# EAGLE board 68030-RAM-IDE-V02 (EAGLE 6.6.0)
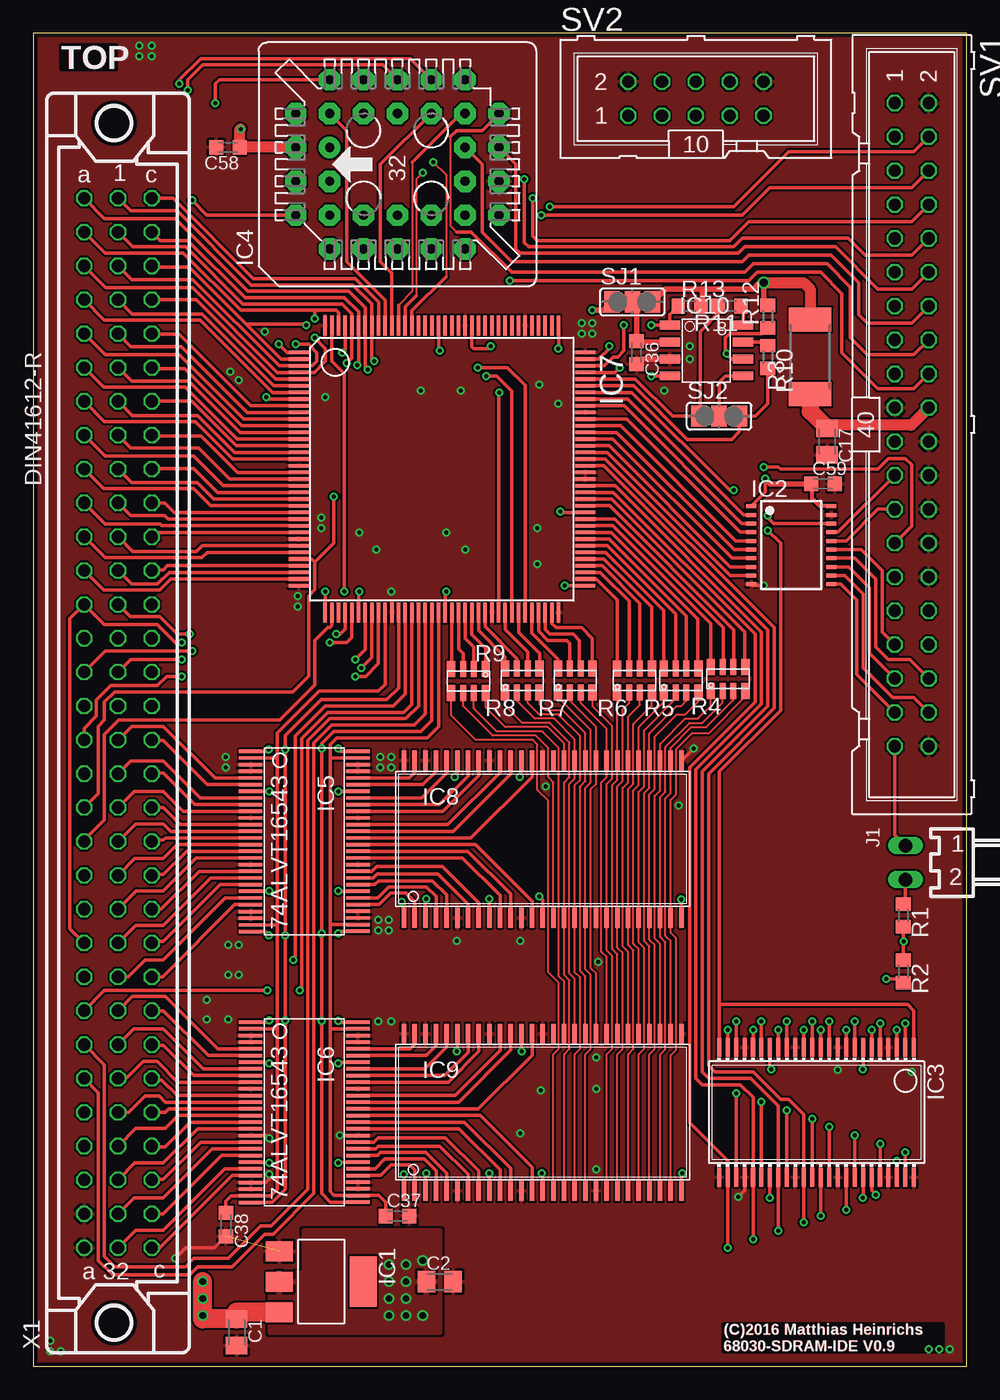
[diagram p3: board, top side]
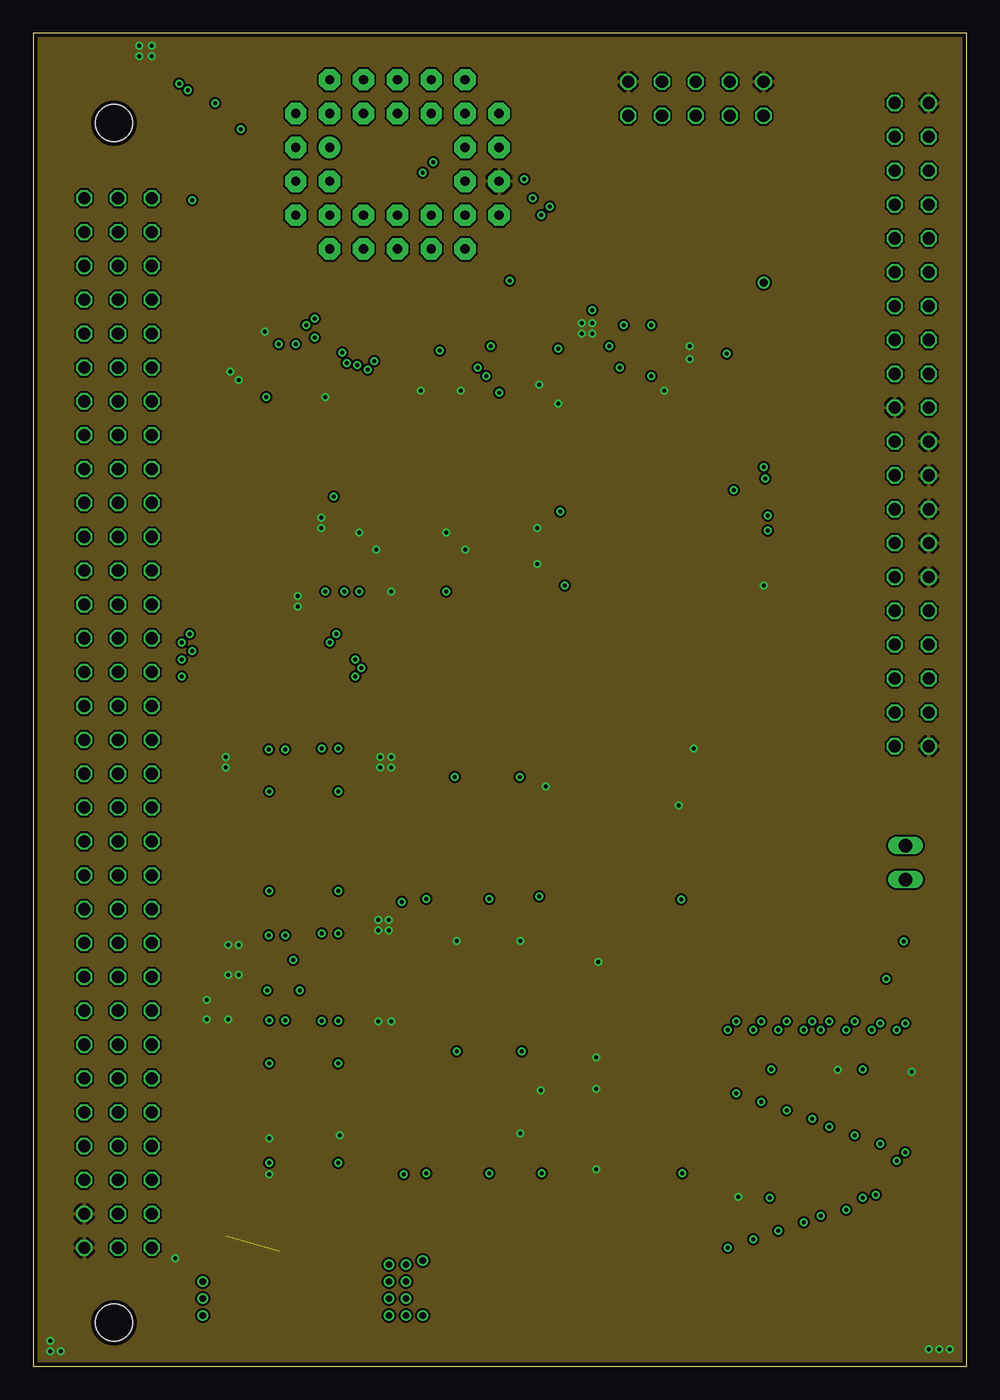
[diagram p4: board, inner layer Route2]
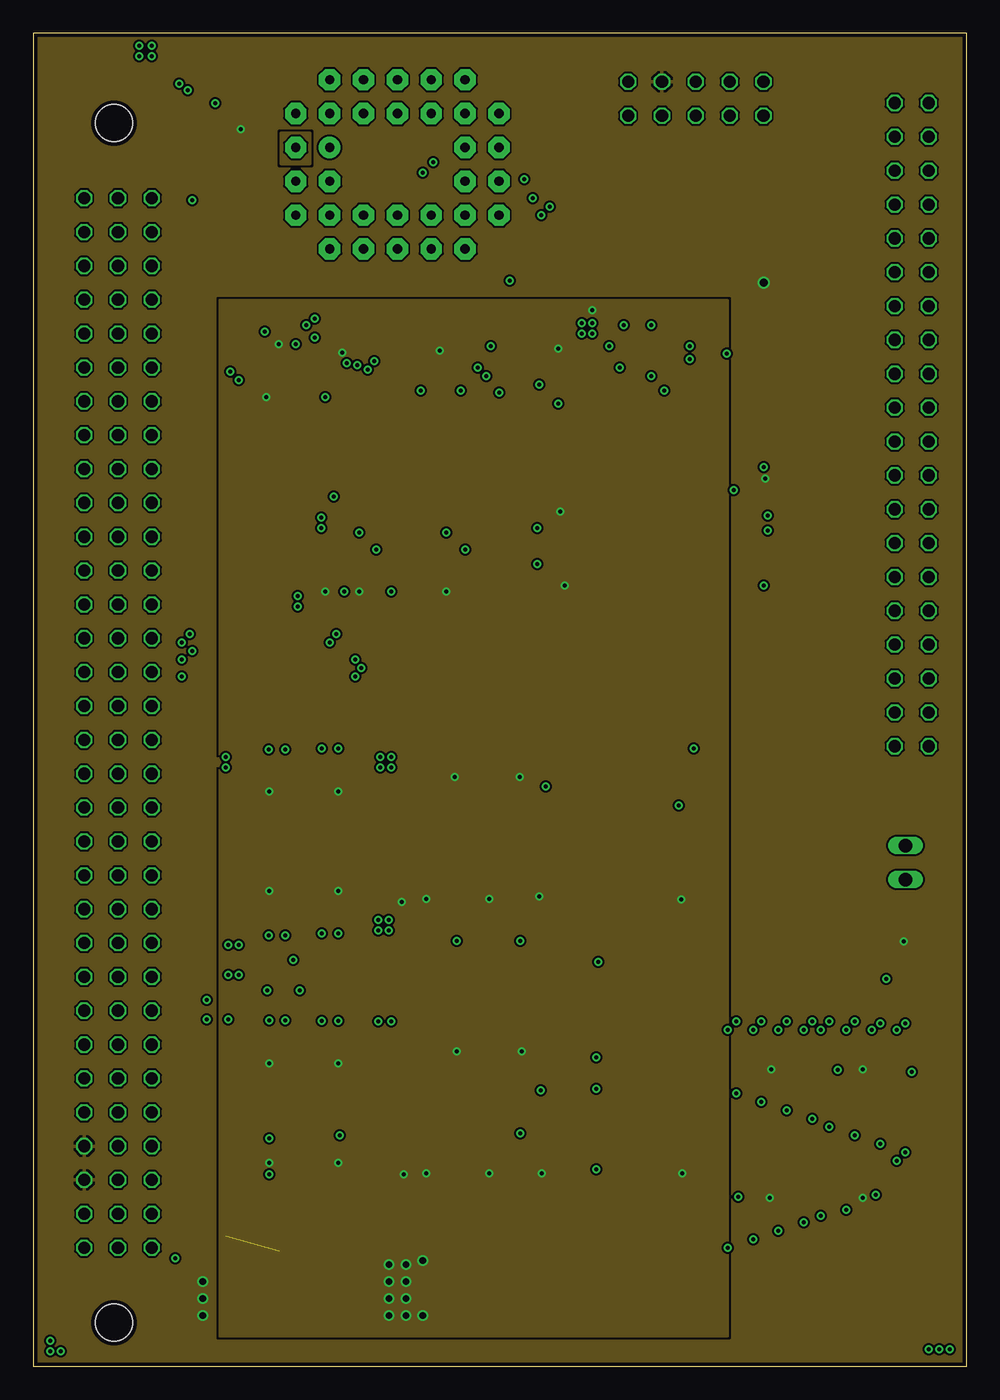
[diagram p5: board, inner layer Route15]
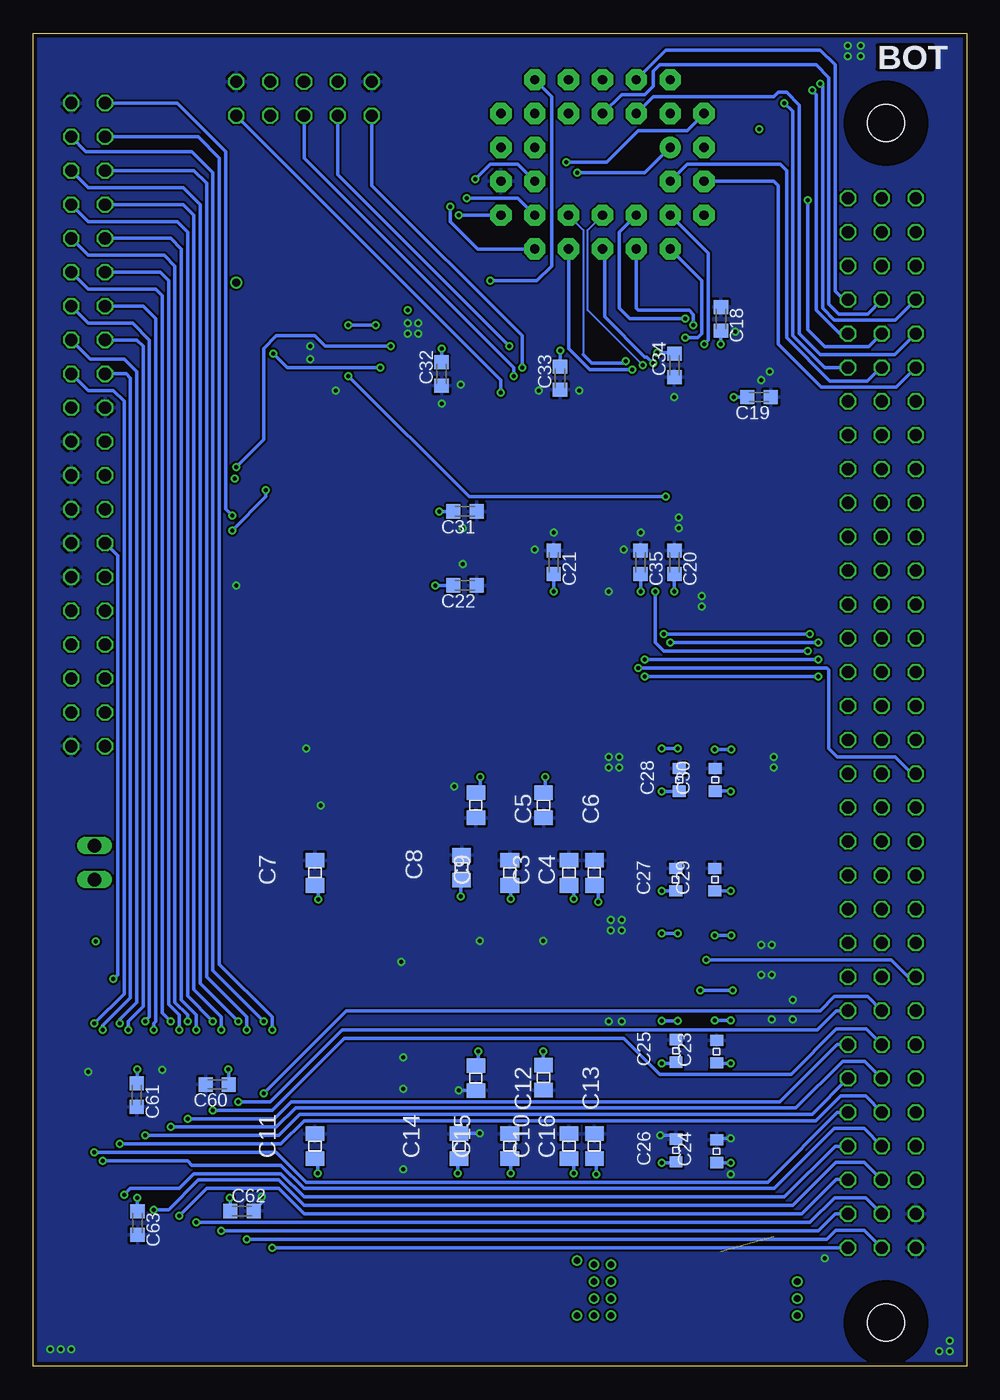
[diagram p6: board, bottom side, seen from below]

Size 69.99 x 100 mm. Coordinates in mm from the lower left corner, seen from the top.
Outline: 0,0 69.99,0 69.99,100 0,100 0,0
Copper layers (1+2*15+16): Top 0.035mm / dielectric 0.36mm / Route2 0.035mm / dielectric 0.71mm / Route15 0.035mm / dielectric 0.36mm / Bottom 0.035mm
Design rules "LeitOn - Standard-Eagle-DRU - 4-Lagen Multilayer - deutsch - Rev 2.0 *": minimum track width 0.15mm, minimum drill 0.3mm, track to track 0.15mm, track to pad 0.15mm, pad to pad 0.15mm, via to via 0.15mm, smd to smd 0.15mm, copper to edge 0.3mm, drill to drill 0.3mm, minimum pad ring 0.15mm, minimum via ring 0.15mm, stop-mask expansion 0.075mm, vias tented up to drill 16mil, thermal gap 0.2mm

## Footprints (pad centres in the part's own frame; a part is rotated, then mirrored left to right if it is on the bottom)
C0805K = smd 1.3 x 1.6: 1 -1,0; 2 1,0
0805 = smd 1.092 x 1.397: 1 -0.94,0; 2 0.94,0
C0603K = smd 1.05 x 1.08: 1 -0.875,0; 2 0.875,0
0603@3 = smd 0.85 x 0.965: 1 -0.846,0; 2 0.846,0
SOT223 = smd 1.499 x 2.007: 1 -2.261,-3.15; 2 0.025,-3.15; 3 2.311,-3.15 | smd 3.81 x 2.007: 4 0,3.15
TSSOP20 = smd 0.3 x 0.75: 1 -2.925,-3; 2 -2.275,-3; 3 -1.625,-3; 4 -0.975,-3; 5 -0.325,-3; 6 0.325,-3; 7 0.975,-3; 8 1.625,-3; 9 2.275,-3; 10 2.925,-3; 11 2.925,3; 12 2.275,3; 13 1.625,3; 14 0.975,3; 15 0.325,3; 16 -0.325,3; 17 -0.975,3; 18 -1.625,3; 19 -2.275,3; 20 -2.925,3
SSOP48DL = smd 0.305 x 1.422: 1 -6.985,-4.877; 2 -6.35,-4.877; 3 -5.715,-4.877; 4 -5.08,-4.877; 5 -4.445,-4.877; 6 -3.81,-4.877; 7 -3.175,-4.877; 8 -2.54,-4.877; 9 -1.905,-4.877; 10 -1.27,-4.877; 11 -0.635,-4.877; 12 0,-4.877; 13 0.635,-4.877; 14 1.27,-4.877; 15 1.905,-4.877; 16 2.54,-4.877; 17 3.175,-4.877; 18 3.81,-4.877; 19 4.445,-4.877; 20 5.08,-4.877; 21 5.715,-4.877; 22 6.35,-4.877; 23 6.985,-4.877; 24 7.62,-4.877; 25 7.62,4.877; 26 6.985,4.877; 27 6.35,4.877; 28 5.715,4.877; 29 5.08,4.877; 30 4.445,4.877; 31 3.81,4.877; 32 3.175,4.877; 33 2.54,4.877; 34 1.905,4.877; 35 1.27,4.877; 36 0.635,4.877; 37 0,4.877; 38 -0.635,4.877; 39 -1.27,4.877; 40 -1.905,4.877; 41 -2.54,4.877; 42 -3.175,4.877; 43 -3.81,4.877; 44 -4.445,4.877; 45 -5.08,4.877; 46 -5.715,4.877; 47 -6.35,4.877; 48 -6.985,4.877
PLCC-SR32 = drill 0.7 pad 1.6: 1 1.27,5.08 | drill 0.7 pad 1.6 octagon: 2 -1.27,7.62; 3 -1.27,5.08; 4 -3.81,7.62; 5 -6.35,5.08; 6 -3.81,5.08; 7 -6.35,2.54; 8 -3.81,2.54; 9 -6.35,0; 10 -3.81,0; 11 -6.35,-2.54; 12 -3.81,-2.54; 13 -6.35,-5.08; 14 -3.81,-7.62; 15 -3.81,-5.08; 16 -1.27,-7.62; 17 -1.27,-5.08; 18 1.27,-7.62; 19 1.27,-5.08; 20 3.81,-7.62; 21 6.35,-5.08; 22 3.81,-5.08; 23 6.35,-2.54; 24 3.81,-2.54; 25 6.35,0; 26 3.81,0; 27 6.35,2.54; 28 3.81,2.54; 29 6.35,5.08; 30 3.81,7.62; 31 3.81,5.08; 32 1.27,7.62
TSSOP56@2 = smd 0.254 x 1.778: 1 -6.762,-4.023; 2 -6.262,-4.023; 3 -5.762,-4.023; 4 -5.262,-4.023; 5 -4.762,-4.023; 6 -4.262,-4.023; 7 -3.762,-4.023; 8 -3.262,-4.023; 9 -2.762,-4.023; 10 -2.262,-4.023; 11 -1.762,-4.023; 12 -1.262,-4.023; 13 -0.762,-4.023; 14 -0.262,-4.023; 15 0.238,-4.023; 16 0.738,-4.023; 17 1.238,-4.023; 18 1.738,-4.023; 19 2.238,-4.023; 20 2.738,-4.023; 21 3.238,-4.023; 22 3.738,-4.023; 23 4.238,-4.023; 24 4.738,-4.023; 25 5.262,-4.023; 26 5.762,-4.023; 27 6.262,-4.023; 28 6.762,-4.023; 29 6.738,4.023; 30 6.238,4.023; 31 5.738,4.023; 32 5.238,4.023; 33 4.738,4.023; 34 4.238,4.023; 35 3.738,4.023; 36 3.238,4.023; 37 2.738,4.023; 38 2.238,4.023; 39 1.738,4.023; 40 1.238,4.023; 41 0.738,4.023; 42 0.238,4.023; 43 -0.262,4.023; 44 -0.762,4.023; 45 -1.262,4.023; 46 -1.762,4.023; 47 -2.262,4.023; 48 -2.762,4.023; 49 -3.262,4.023; 50 -3.762,4.023; 51 -4.262,4.023; 52 -4.762,4.023; 53 -5.262,4.023; 54 -5.762,4.023; 55 -6.262,4.023; 56 -6.762,4.023
TQFP144 = smd 0.27 x 1.5: 1 -8.75,-10.75; 2 -8.25,-10.75; 3 -7.75,-10.75; 4 -7.25,-10.75; 5 -6.75,-10.75; 6 -6.25,-10.75; 7 -5.75,-10.75; 8 -5.25,-10.75; 9 -4.75,-10.75; 10 -4.25,-10.75; 11 -3.75,-10.75; 12 -3.25,-10.75; 13 -2.75,-10.75; 14 -2.25,-10.75; 15 -1.75,-10.75; 16 -1.25,-10.75; 17 -0.75,-10.75; 18 -0.25,-10.75; 19 0.25,-10.75; 20 0.75,-10.75; 21 1.25,-10.75; 22 1.75,-10.75; 23 2.25,-10.75; 24 2.75,-10.75; 25 3.25,-10.75; 26 3.75,-10.75; 27 4.25,-10.75; 28 4.75,-10.75; 29 5.25,-10.75; 30 5.75,-10.75; 31 6.25,-10.75; 32 6.75,-10.75; 33 7.25,-10.75; 34 7.75,-10.75; 35 8.25,-10.75; 36 8.75,-10.75; 73 8.75,10.75; 74 8.25,10.75; 75 7.75,10.75; 76 7.25,10.75; 77 6.75,10.75; 78 6.25,10.75; 79 5.75,10.75; 80 5.25,10.75; 81 4.75,10.75; 82 4.25,10.75; 83 3.75,10.75; 84 3.25,10.75; 85 2.75,10.75; 86 2.25,10.75; 87 1.75,10.75; 88 1.25,10.75; 89 0.75,10.75; 90 0.25,10.75; 91 -0.25,10.75; 92 -0.75,10.75; 93 -1.25,10.75; 94 -1.75,10.75; 95 -2.25,10.75; 96 -2.75,10.75; 97 -3.25,10.75; 98 -3.75,10.75; 99 -4.25,10.75; 100 -4.75,10.75; 101 -5.25,10.75; 102 -5.75,10.75; 103 -6.25,10.75; 104 -6.75,10.75; 105 -7.25,10.75; 106 -7.75,10.75; 107 -8.25,10.75; 108 -8.75,10.75 | smd 1.5 x 0.27: 37 10.75,-8.75; 38 10.75,-8.25; 39 10.75,-7.75; 40 10.75,-7.25; 41 10.75,-6.75; 42 10.75,-6.25; 43 10.75,-5.75; 44 10.75,-5.25; 45 10.75,-4.75; 46 10.75,-4.25; 47 10.75,-3.75; 48 10.75,-3.25; 49 10.75,-2.75; 50 10.75,-2.25; 51 10.75,-1.75; 52 10.75,-1.25; 53 10.75,-0.75; 54 10.75,-0.25; 55 10.75,0.25; 56 10.75,0.75; 57 10.75,1.25; 58 10.75,1.75; 59 10.75,2.25; 60 10.75,2.75; 61 10.75,3.25; 62 10.75,3.75; 63 10.75,4.25; 64 10.75,4.75; 65 10.75,5.25; 66 10.75,5.75; 67 10.75,6.25; 68 10.75,6.75; 69 10.75,7.25; 70 10.75,7.75; 71 10.75,8.25; 72 10.75,8.75; 109 -10.75,8.75; 110 -10.75,8.25; 111 -10.75,7.75; 112 -10.75,7.25; 113 -10.75,6.75; 114 -10.75,6.25; 115 -10.75,5.75; 116 -10.75,5.25; 117 -10.75,4.75; 118 -10.75,4.25; 119 -10.75,3.75; 120 -10.75,3.25; 121 -10.75,2.75; 122 -10.75,2.25; 123 -10.75,1.75; 124 -10.75,1.25; 125 -10.75,0.75; 126 -10.75,0.25; 127 -10.75,-0.25; 128 -10.75,-0.75; 129 -10.75,-1.25; 130 -10.75,-1.75; 131 -10.75,-2.25; 132 -10.75,-2.75; 133 -10.75,-3.25; 134 -10.75,-3.75; 135 -10.75,-4.25; 136 -10.75,-4.75; 137 -10.75,-5.25; 138 -10.75,-5.75; 139 -10.75,-6.25; 140 -10.75,-6.75; 141 -10.75,-7.25; 142 -10.75,-7.75; 143 -10.75,-8.25; 144 -10.75,-8.75
TSOP2-54@2 = smd 0.34 x 1.5: 1 -9,-5.9; 2 -8.2,-5.9; 3 -7.4,-5.9; 4 -6.6,-5.9; 5 -5.8,-5.9; 6 -5,-5.9; 7 -4.2,-5.9; 8 -3.4,-5.9; 9 -2.6,-5.9; 10 -1.8,-5.9; 11 -1,-5.9; 12 -0.2,-5.9; 13 0.6,-5.9; 14 1.4,-5.9; 15 2.2,-5.9; 16 3,-5.9; 17 3.8,-5.9; 18 4.6,-5.9; 19 5.4,-5.9; 20 6.2,-5.9; 21 7,-5.9; 22 7.8,-5.9; 23 8.6,-5.9; 24 9.4,-5.9; 25 10.2,-5.9; 26 11,-5.9; 27 11.8,-5.9; 28 11.8,5.9; 29 11,5.9; 30 10.2,5.9; 31 9.4,5.9; 32 8.6,5.9; 33 7.8,5.9; 34 7,5.9; 35 6.2,5.9; 36 5.4,5.9; 37 4.6,5.9; 38 3.8,5.9; 39 3,5.9; 40 2.2,5.9; 41 1.4,5.9; 42 0.6,5.9; 43 -0.2,5.9; 44 -1,5.9; 45 -1.8,5.9; 46 -2.6,5.9; 47 -3.4,5.9; 48 -4.2,5.9; 49 -5,5.9; 50 -5.8,5.9; 51 -6.6,5.9; 52 -7.4,5.9; 53 -8.2,5.9; 54 -9,5.9
SO-8 = smd 0.66 x 1.524: 1 -1.27,-2.743; 2 0,-2.743; 3 1.27,-2.743; 4 2.54,-2.743; 5 2.54,2.743; 6 1.27,2.743; 7 0,2.743; 8 -1.27,2.743
7395-02 = drill 1.016 long: 1 1.27,0; 2 -1.27,0
R0603 = smd 1 x 1.1: 1 -0.85,0; 2 0.85,0
R2512 = smd 1.8 x 3.2: 1 -2.8,0; 2 2.8,0
R-NETZ@2 = smd 0.63 x 1.2: P$1 -1.3,-0.9; P$4 1.3,-0.9; P$5 1.3,0.9; P$8 -1.3,0.9 | smd 0.45 x 1.2: P$2 -0.4,-0.9; P$3 0.4,-0.9; P$6 0.4,0.9; P$7 -0.4,0.9
SJ_2 = smd 1.168 x 1.6: 1 -1.524,0; 2 0,0; 3 1.524,0
ML40 = drill 0.914 octagon: 1 -24.13,-1.27; 2 -24.13,1.27; 3 -21.59,-1.27; 4 -21.59,1.27; 5 -19.05,-1.27; 6 -19.05,1.27; 7 -16.51,-1.27; 8 -16.51,1.27; 9 -13.97,-1.27; 10 -13.97,1.27; 11 -11.43,-1.27; 12 -11.43,1.27; 13 -8.89,-1.27; 14 -8.89,1.27; 15 -6.35,-1.27; 16 -6.35,1.27; 17 -3.81,-1.27; 18 -3.81,1.27; 19 -1.27,-1.27; 20 -1.27,1.27; 21 1.27,-1.27; 22 1.27,1.27; 23 3.81,-1.27; 24 3.81,1.27; 25 6.35,-1.27; 26 6.35,1.27; 27 8.89,-1.27; 28 8.89,1.27; 29 11.43,-1.27; 30 11.43,1.27; 31 13.97,-1.27; 32 13.97,1.27; 33 16.51,-1.27; 34 16.51,1.27; 35 19.05,-1.27; 36 19.05,1.27; 37 21.59,-1.27; 38 21.59,1.27; 39 24.13,-1.27; 40 24.13,1.27
ML10 = drill 0.914 octagon: 1 -5.08,-1.27; 2 -5.08,1.27; 3 -2.54,-1.27; 4 -2.54,1.27; 5 0,-1.27; 6 0,1.27; 7 2.54,-1.27; 8 2.54,1.27; 9 5.08,-1.27; 10 5.08,1.27
MABC96R = drill 0.914 octagon: A1 -2.54,39.37; A2 -2.54,36.83; A3 -2.54,34.29; A4 -2.54,31.75; A5 -2.54,29.21; A6 -2.54,26.67; A7 -2.54,24.13; A8 -2.54,21.59; A9 -2.54,19.05; A10 -2.54,16.51; A11 -2.54,13.97; A12 -2.54,11.43; A13 -2.54,8.89; A14 -2.54,6.35; A15 -2.54,3.81; A16 -2.54,1.27; A17 -2.54,-1.27; A18 -2.54,-3.81; A19 -2.54,-6.35; A20 -2.54,-8.89; A21 -2.54,-11.43; A22 -2.54,-13.97; A23 -2.54,-16.51; A24 -2.54,-19.05; A25 -2.54,-21.59; A26 -2.54,-24.13; A27 -2.54,-26.67; A28 -2.54,-29.21; A29 -2.54,-31.75; A30 -2.54,-34.29; A31 -2.54,-36.83; A32 -2.54,-39.37; B1 0,39.37; B2 0,36.83; B3 0,34.29; B4 0,31.75; B5 0,29.21; B6 0,26.67; B7 0,24.13; B8 0,21.59; B9 0,19.05; B10 0,16.51; B11 0,13.97; B12 0,11.43; B13 0,8.89; B14 0,6.35; B15 0,3.81; B16 0,1.27; B17 0,-1.27; B18 0,-3.81; B19 0,-6.35; B20 0,-8.89; B21 0,-11.43; B22 0,-13.97; B23 0,-16.51; B24 0,-19.05; B25 0,-21.59; B26 0,-24.13; B27 0,-26.67; B28 0,-29.21; B29 0,-31.75; B30 0,-34.29; B31 0,-36.83; B32 0,-39.37; C1 2.54,39.37; C2 2.54,36.83; C3 2.54,34.29; C4 2.54,31.75; C5 2.54,29.21; C6 2.54,26.67; C7 2.54,24.13; C8 2.54,21.59; C9 2.54,19.05; C10 2.54,16.51; C11 2.54,13.97; C12 2.54,11.43; C13 2.54,8.89; C14 2.54,6.35; C15 2.54,3.81; C16 2.54,1.27; C17 2.54,-1.27; C18 2.54,-3.81; C19 2.54,-6.35; C20 2.54,-8.89; C21 2.54,-11.43; C22 2.54,-13.97; C23 2.54,-16.51; C24 2.54,-19.05; C25 2.54,-21.59; C26 2.54,-24.13; C27 2.54,-26.67; C28 2.54,-29.21; C29 2.54,-31.75; C30 2.54,-34.29; C31 2.54,-36.83; C32 2.54,-39.37 | hole 2.794: -0.305,45; -0.305,-45

## Placement (x,y rotation side)
C1  47µF  [C0805K]  15.24,2.54 270 top
C2  47µF  [C0805K]  30.48,6.35 0 top
C3  100nF  [0805]  29.82,37.01 90 bottom
C4  100nF  [0805]  27.91,37.01 90 bottom
C5  100nF  [0805]  36.8,42.09 270 bottom
C6  100nF  [0805]  31.72,42.09 270 bottom
C7  100nF  [0805]  48.87,37.01 90 bottom
C8  100nF  [0805]  37.87,37.41 90 bottom
C9  100nF  [0805]  34.26,37.01 90 bottom
C10  100nF  [0805]  29.82,16.51 90 bottom
C11  100nF  [0805]  48.87,16.51 90 bottom
C12  100nF  [0805]  36.8,21.62 270 bottom
C13  100nF  [0805]  31.72,21.64 270 bottom
C14  100nF  [0805]  38.07,16.51 90 bottom
C15  100nF  [0805]  34.26,16.51 90 bottom
C16  100nF  [0805]  27.91,16.51 90 bottom
C17  47µF  [C0805K]  59.53,69.37 270 top
C18  100nF  [C0603K]  18.41,78.58 270 bottom
C19  100nF  [C0603K]  15.56,72.71 180 bottom
C20  100nF  [C0603K]  21.91,60.33 270 bottom
C21  100nF  [C0603K]  30.96,60.33 270 bottom
C22  100nF  [C0603K]  37.62,58.58 180 bottom
C23  10nF  [0603@3]  18.75,23.6 90 bottom
C24  10nF  [0603@3]  18.75,16.13 90 bottom
C25  10nF  [0603@3]  21.79,23.65 90 bottom
C26  10nF  [0603@3]  21.79,16.18 90 bottom
C27  10nF  [0603@3]  21.82,36.5 90 bottom
C28  10nF  [0603@3]  21.54,43.99 90 bottom
C29  10nF  [0603@3]  18.87,36.5 90 bottom
C30  10nF  [0603@3]  18.85,43.99 90 bottom
C31  100nF  [C0603K]  37.62,64.14 180 bottom
C32  100nF  [C0603K]  39.37,74.45 90 bottom
C33  100nF  [C0603K]  30.48,74.14 90 bottom
C34  100nF  [C0603K]  21.91,75.09 90 bottom
C35  100nF  [C0603K]  24.45,60.33 270 bottom
C36  100nF  [C0603K]  45.24,76.04 270 top
C37  100pF  [C0603K]  27.3,11.27 0 top
C38  100pF  [C0603K]  14.45,10.64 270 top
C58  100nF  [C0603K]  14.61,91.44 180 top
C59  100nF  [C0603K]  59.21,66.2 0 top
C60  100nF  [C0603K]  56.2,21.14 180 bottom
C61  100nF  [C0603K]  62.23,20.35 270 bottom
C62  100nF  [C0603K]  54.34,11.64 0 bottom
C63  100nF  [C0603K]  62.17,10.74 270 bottom
IC1  REG1117  [SOT223]  21.59,6.35 270 top
IC2  74HCT245PW  [TSSOP20]  56.83,61.59 270 top
IC3  74AC16245  [SSOP48DL]  59.05,19.05 180 top
IC4  AM29F010S  [PLCC-SR32]  27.3,90.17 90 top
IC5  74ALVT16543  [TSSOP56@2]  20.32,39.37 270 top
IC6  74ALVT16543  [TSSOP56@2]  20.32,19.05 270 top
IC7  XC95288XL-TQ144  [TQFP144]  30.64,67.31 270 top
IC8  K4S56163  [TSOP2-54@2]  36.8,39.55 0 top
IC9  K4S56163  [TSOP2-54@2]  36.8,19.05 0 top
IC10  ICS570B  [SO-8]  50.48,76.83 270 top
J1  22-05-7028-02  [7395-02]  65.41,37.78 90 top
R1  330  [R0603]  65.25,33.81 270 top
R2  4k7  [R0603]  65.25,29.62 270 top
R3  500mA  [R2512]  58.26,75.72 90 top
R4  33R  [R-NETZ@2]  52.1,51.58 0 top
R5  33R  [R-NETZ@2]  48.58,51.44 0 top
R6  33R  [R-NETZ@2]  45.09,51.44 0 top
R7  33R  [R-NETZ@2]  40.64,51.44 0 top
R8  33R  [R-NETZ@2]  36.67,51.44 0 top
R9  33R  [R-NETZ@2]  32.63,51.4 180 top
R10  33  [R0603]  55.09,75.72 270 top
R11  33  [R0603]  52.23,79.53 180 top
R12  4k7  [R0603]  55.09,78.74 90 top
R13  4k7  [R0603]  49.21,79.53 0 top
SJ1  [SJ_2]  44.93,79.85 0 top
SJ2  [SJ_2]  51.44,71.28 0 top
SV1  [ML40]  65.88,70.64 270 top
SV2  [ML10]  49.69,95.09 0 top
X1  MABC96R  [MABC96R]  6.35,48.26 0 top

## Tracks (layer width: path | path; a pad name or v marks a point on that pad's centre or on a via)
!AS
  Top 0.254: X1.C12 8.94,59.74 9.73,59.74 10.05,60.06 IC7.33
!DS  (via drill 0.3)
  Top 0.254: X1.A23 2.74,32.82 2.74,56.08 X1.A13 5.33,55.63 9.31,55.63 10.64,54.29 v11.11,54.29 | v22.23,54.29 23.5,54.29 23.89,54.69 IC7.41
  Bottom 0.254: v11.11,54.29 v22.23,54.29
!IDE_ACT
  Top 0.254: SV1.39 64.61,39.85 J1.1
!IDE_R
  Top 0.254: IC2.16 60.97,61.92 63.34,64.29 SV1.25
!IDE_W
  Top 0.254: IC2.17 60.35,62.57 SV1.23
!RESET  (via drill 0.3)
  Top 0.254: X1.A15 5.38,53.65 11.89,53.65 v11.91,53.66 | v23.34,58.1 23.34,74.45 22.39,75.4 IC7.143
  Bottom 0.254: v11.91,53.66 22.7,53.66 23.34,54.29 v23.34,58.1
+3V3  (via drill 0.3, 0.5)
  Top 0.254: IC8.49 31.8,44.4 v31.59,44.2 | IC8.1 27.8,34.68 v27.63,34.85 | IC8.3 29.4,34.99 v29.46,35.05 | IC8.43 36.6,44.33 v36.47,44.2 | IC8.9 34.2,35.04 v34.18,35.05 | IC8.14 38.2,35 v37.95,35.25 | IC8.27 v48.6,34.99 v48.61,35 | IC9.49 31.8,23.68 v31.75,23.62 | IC9.43 36.6,23.64 v36.62,23.62 | IC9.27 48.6,14.42 v48.66,14.48 | IC9.14 38.2,14.42 v38.15,14.48 | IC9.9 34.2,14.46 v34.18,14.48 | IC9.1 27.8,14.38 v27.78,14.4 | IC9.3 29.4,14.42 v29.46,14.48 | v17.68,43.13 IC5.7 | IC5.50 v22.86,43.13 | IC5.22 17.65,35.63 v17.68,35.66 | IC5.35 22.89,35.63 v22.86,35.66 | IC6.22 17.61,15.31 v17.68,15.24 | IC6.35 22.93,15.31 v22.86,15.24 | IC6.7 17.57,22.81 v17.68,22.71 | IC6.50 22.96,22.81 v22.86,22.71 | IC7.55 30.89,58.03 v30.96,58.1 | IC7.73 39.87,58.56 v39.85,58.58 | IC7.37 21.89,58.08 v21.91,58.1 | v23.18,76.04 23.39,76.25 IC7.141 | v39.37,76.36 39.39,76.38 IC7.109 | v39.53,64.14 39.6,64.06 IC7.84 | v24.45,58.1 24.39,58.04 IC7.42 | IC7.8 17.61,72.56 v17.46,72.71 | v18.41,76.68 19.03,76.06 IC7.1 | v30.48,76.2 30.39,76.29 IC7.127
  Top 0.406: SJ1.1 42.77,79.22 v41.91,79.22
  Bottom 0.254: v31.59,44.2 31.59,43.16 C6.1 | v27.63,34.85 27.63,35.79 C4.1 | v29.46,35.05 29.46,35.71 C3.1 | v36.47,44.2 36.47,43.36 C5.1 | v34.18,35.05 34.18,35.99 C9.1 | v37.95,35.25 37.95,36.39 C8.1 | v48.61,35 48.61,35.81 C7.1 | v31.75,23.62 31.75,22.55 C13.1 | v36.62,23.62 36.62,22.73 C12.1 | v48.66,14.48 48.66,15.37 C11.1 | v38.15,14.48 38.15,15.49 C14.1 | v34.18,14.48 34.18,15.49 C15.1 | v27.78,14.4 27.78,15.44 C16.1 | v29.46,14.48 29.46,15.21 C10.1 | C30.1 17.7,43.15 v17.68,43.13 | v22.86,43.13 21.56,43.13 C28.1 | v17.68,35.66 18.86,35.66 C29.1 | v22.86,35.66 21.83,35.66 C27.1 | v17.68,15.24 18.7,15.24 C24.1 | v22.86,15.24 21.89,15.24 C26.1 | v17.68,22.71 18.7,22.71 C23.1 | v22.86,22.71 21.89,22.71 C25.1 | v30.96,58.1 C21.2 | v39.85,58.58 C22.2 | v21.91,58.1 C20.2 | v18.41,76.68 C18.2 | v17.46,72.71 C19.2 | C33.2 v30.48,76.2 | C32.2 v39.37,76.36 | C31.2 v39.53,64.14 | C35.2 v24.45,58.1 | C34.2 21.98,76.04 v23.18,76.04
  other vias: 29.21,3.81 29.21,7.94 27.94,7.62 26.67,7.62 26.67,6.35 27.94,6.35 27.94,5.08 26.67,5.08 26.67,3.81 27.94,3.81
  pour Route15 (rank 2): 13.97,80.01 52.07,80.01 52.07,2.22 13.97,2.22
  pour Top (rank 2): 20.32,10.16 30.48,10.16 30.48,2.54 17.78,2.54 17.78,6.99 20.32,6.99
A0
  Top 0.254: IC7.136 25.89,79.84 24.13,81.6 16.51,81.6 10.48,87.63 X1.C1
A1  (via drill 0.3)
  Top 0.254: X1.B1 7.3,86.68 10.79,86.68 16.35,81.12 23.97,81.12 25.39,79.7 IC7.137 25.39,75.58 v25.56,75.41
  Bottom 0.152: IC4.12 28.73,85.25 28.73,75.88
  Bottom 0.254: 28.73,75.88 28.1,75.25 25.72,75.25 v25.56,75.41
A2  (via drill 0.3)
  Top 0.254: X1.A1 5.33,86.11 10.64,86.11 16.1,80.64 23.65,80.64 24.89,79.41 IC7.138 24.89,74.97 v25.08,74.77
  Bottom 0.254: IC4.11 29.84,76.36 28.26,74.77 v25.08,74.77
A3  (via drill 0.3)
  Top 0.254: 8.94,85.04 X1.C2 9.53,84.45 11.59,84.45 15.88,80.17 23.34,80.17 24.39,79.12 IC7.139 24.39,75.19 v24.29,75.09
  Bottom 0.152: v24.29,75.09 28.42,79.22 28.42,85.25 IC4.10
A4  (via drill 0.3)
  Top 0.254: X1.B2 7.46,83.98 11.43,83.98 15.72,79.69 23.18,79.69 23.89,78.98 IC7.140 23.89,75.64 v23.5,75.25
  Bottom 0.254: IC4.9 27.15,83.66 27.15,78.74 24.13,75.72 23.97,75.72 v23.5,75.25
A5  (via drill 0.3)
  Top 0.254: X1.A2 5.38,83.52 11.26,83.52 15.56,79.22 21.11,79.22 | IC7.142 22.89,79.03 22.7,79.22 21.11,79.22 | v21.11,78.58 21.11,79.22
  Bottom 0.254: IC4.8 26.04,85.09 26.04,79.38 25.24,78.58 v21.11,78.58
A6  (via drill 0.3)
  Top 0.254: X1.C3 8.99,82.45 11.69,82.45 15.95,78.18 | IC7.2 18.58,75.56 15.95,78.18 | 15.95,78.18 20.4,78.18 v20.48,78.11
  Bottom 0.254: IC4.7 24.77,79.38 24.61,79.22 20.8,79.22 20.48,78.9 v20.48,78.11
A7  (via drill 0.3)
  Top 0.254: X1.B3 7.37,81.53 11.97,81.53 18.44,75.06 IC7.3 20.93,75.06 21.27,75.41 21.27,76.04 20.64,76.68 v19.68,76.68
  Bottom 0.254: IC4.6 19.37,83.5 19.37,76.99 v19.68,76.68
A8  (via drill 0.3)
  Top 0.254: X1.A3 5.44,80.92 11.94,80.92 18.31,74.56 IC7.4 21.06,74.56 21.91,75.41 21.91,76.36 v21.11,77.15
  Bottom 0.254: IC4.5 19.84,81.44 19.84,77.47 20.16,77.15 v21.11,77.15
A9
  Top 0.254: X1.C4 12.22,80.01 18.17,74.06 IC7.5
  Bottom 0.254: IC4.27 22.54,98.74 10.95,98.74 9.84,97.63 9.84,80.64 9.21,80.01 X1.C4
A10
  Top 0.254: X1.B4 7.42,78.94 12.66,78.94 18.04,73.56 IC7.6
  Bottom 0.254: IC4.26 25.88,95.41 24.13,95.41 23.5,96.04 23.5,97.16 23.02,97.63 11.27,97.63 10.32,96.68 10.32,79.69 9.57,78.94 7.42,78.94 X1.B4
A11  (via drill 0.3)
  Top 0.254: X1.A4 5.33,78.49 12.52,78.49 17.94,73.06 IC7.7 | IC4.23 28.26,98.11 12.54,98.11 10.95,96.52 v10.95,96.2
  Bottom 0.254: v10.95,96.2 10.79,96.04 10.79,79.38 9.91,78.49 5.33,78.49 X1.A4
A12  (via drill 0.3)
  Top 0.254: X1.C5 8.94,77.42 10.93,77.42 16.29,72.06 IC7.9 | IC4.25 26.19,97.63 12.7,97.63 11.59,96.52 v11.59,95.73
  Bottom 0.254: v11.59,95.73 11.27,95.41 11.27,79.22 9.53,77.47 X1.C5
A13  (via drill 0.3)
  Top 0.254: X1.B5 7.32,76.5 11.09,76.5 16.03,71.56 IC7.10 | IC4.4 13.02,86.36 v11.91,87.47
  Bottom 0.254: v11.91,87.47 11.91,77.79 10.62,76.5 7.32,76.5 X1.B5
A14
  Top 0.254: X1.A5 5.38,75.89 10.93,75.89 15.76,71.06 IC7.11
  Bottom 0.254: IC4.28 23.5,95.25 14.45,95.25 14.13,95.57 13.49,95.57 12.54,94.61 12.54,77.47 10.97,75.89 5.38,75.89 X1.A5
A15  (via drill 0.3)
  Top 0.254: X1.C6 8.99,74.83 11.37,74.83 15.64,70.56 IC7.12 | IC4.29 13.97,96.52 13.65,96.2 v13.65,94.77
  Bottom 0.254: v13.65,94.77 13.02,94.14 13.02,77.31 10.64,74.93 X1.C6
A16
  Top 0.254: X1.B6 7.37,73.91 11.65,73.91 15.51,70.06 IC7.13
  Bottom 0.254: IC4.3 20.95,90.17 13.97,90.17 13.49,89.69 13.49,77.15 10.26,73.91 7.46,73.91 6.45,74.93 X1.B6
A17
  Top 0.254: X1.A6 5.28,73.46 11.4,73.46 15.3,69.56 IC7.14
  Bottom 0.254: IC4.2 14.45,88.9 14.13,88.58 14.13,76.68 10.91,73.46 5.28,73.46 X1.A6
A18
  Top 0.254: X1.C7 11.89,72.39 15.22,69.06 IC7.15
A19
  Top 0.254: X1.B7 7.42,71.32 12.34,71.32 15.1,68.56 IC7.16
A20
  Top 0.254: X1.A7 5.33,70.87 12.16,70.87 14.97,68.06 IC7.17
A21
  Top 0.254: X1.C8 8.94,69.8 12.59,69.8 15.33,67.06 IC7.19
A22
  Top 0.254: X1.B8 7.32,68.89 12.39,68.89 14.72,66.56 IC7.20
A23
  Top 0.254: X1.A8 5.38,68.28 12.04,68.28 14.26,66.06 IC7.21
A24
  Top 0.254: X1.C9 8.94,67.36 12.04,67.36 13.84,65.56 IC7.22
A25
  Top 0.254: X1.B9 7.37,66.29 12.29,66.29 13.52,65.06 IC7.23
A26
  Top 0.254: X1.A9 5.28,65.84 12.04,65.84 13.32,64.56 IC7.24
A27
  Top 0.254: X1.C10 9.84,64.77 10.55,64.06 IC7.25
A28
  Top 0.254: X1.B10 7.3,63.82 9.84,63.82 10.1,63.56 IC7.26
A29
  Top 0.254: X1.A10 5.4,63.18 9.53,63.18 9.65,63.06 IC7.27
A30
  Top 0.254: X1.C11 9.22,62.56 IC7.28
A31
  Top 0.254: X1.B11 7.46,61.12 12.22,61.12 12.66,61.56 IC7.30
ARAM_0
  Top 0.152: IC9.23 45.4,23.4 45.8,23.8 45.8,31.4 45.4,31.8 IC8.23 45.4,43.1 45.8,43.5 45.8,47.7 48.18,50.08 R5.P$2
ARAM_1
  Top 0.152: IC9.24 46.2,23.4 46.6,23.8 46.6,31.6 46.2,32 IC8.24 46.2,42.9 46.6,43.3 46.6,47.23 48.26,48.9 48.9,48.9 49.88,49.88 R5.P$4 49.88,50.51
ARAM_2
  Top 0.152: IC9.25 47,23.39 47.4,23.79 47.4,31.8 47,32.2 IC8.25 47,42.7 47.4,43.1 47.4,46.45 49.21,48.26 50.16,48.26 51.7,49.8 R4.P$2
ARAM_3
  Top 0.152: IC9.26 47.8,23.32 48.2,23.73 48.2,32.11 47.8,32.51 IC8.26 47.8,42.5 48.2,42.9 48.2,46.3 49.42,47.52 50.7,47.52 53.41,50.23 R4.P$4
ARAM_4
  Top 0.152: IC9.29 47.8,31.9 47.4,32.3 47.4,42.6 47.8,43 IC8.29 47.8,46.4 49.34,47.94 50.48,47.94 52.51,49.97 R4.P$3
ARAM_5
  Top 0.152: IC9.30 47,31.7 46.6,32.1 46.6,42.8 47,43.2 IC8.30 47,46.68 48.9,48.58 49.85,48.58 50.8,49.53 R4.P$1
ARAM_6
  Top 0.152: IC9.31 46.2,31.5 45.8,31.9 45.8,43 46.2,43.4 IC8.31 46.2,47.47 48.26,49.53 48.58,49.53 48.98,49.93 R5.P$3 48.98,50.25
ARAM_7
  Top 0.152: IC9.32 45.4,31.3 45,31.7 45,43.2 45.4,43.6 IC8.32 45.4,47.94 47.28,49.82 R5.P$1
ARAM_8
  Top 0.152: IC9.33 44.6,31.1 44.2,31.5 44.2,43.4 44.6,43.8 IC8.33 44.6,48.73 45.48,49.61 R6.P$3
ARAM_9
  Top 0.152: IC9.34 43.8,30.9 43.4,31.3 43.4,43.6 43.8,44 IC8.34 43.8,50.52 R6.P$1
ARAM_10
  Top 0.152: IC9.22 44.6,23.4 45,23.8 45,31.2 44.6,31.6 IC8.22 44.6,43.3 45,43.7 45,48.17 46.38,49.56 R6.P$4
ARAM_11
  Top 0.152: IC9.35 43,30.7 42.6,31.1 42.6,43.8 43,44.2 IC8.35 43,47.8 41.04,49.77 R7.P$3
ARAM_12
  Top 0.152: IC9.36 42.2,29.46 41.8,29.86 41.8,43.3 42.2,43.7 IC8.36 42.2,47.97 40.24,49.93 R7.P$2
BA0
  Top 0.152: IC9.20 43,23.4 43.4,23.8 43.4,30.8 43,31.2 IC8.20 43,43.7 43.4,44.1 43.4,48.04 41.94,49.5 R7.P$4
BA1
  Top 0.152: IC9.21 43.8,23.4 44.2,23.8 44.2,31 43.8,31.4 IC8.21 43.8,43.5 44.2,43.9 44.2,49.28 44.69,49.77 R6.P$2
C_ARAM_0
  Top 0.254: R5.P$7 48.18,56.44 43.06,61.56 IC7.79
C_ARAM_1
  Top 0.254: R5.P$5 49.85,52.37 49.85,56.04 43.33,62.56 IC7.81
C_ARAM_2
  Top 0.254: R4.P$7 51.75,52.52 51.75,55.4 43.6,63.56 IC7.83
C_ARAM_3
  Top 0.254: R4.P$5 53.34,52.54 53.34,55.09 43.37,65.06 IC7.86
C_ARAM_4
  Top 0.254: R4.P$6 52.55,52.52 52.55,55.24 43.23,64.56 IC7.85
C_ARAM_5
  Top 0.254: R4.P$8 50.8,55.72 43.46,63.06 IC7.82
C_ARAM_6
  Top 0.254: R5.P$6 48.98,56.27 43.19,62.06 IC7.80
C_ARAM_7
  Top 0.254: R5.P$8 47.28,56.7 42.92,61.06 IC7.78
C_ARAM_8
  Top 0.254: R6.P$6 45.48,57.23 42.65,60.06 IC7.76
C_ARAM_9
  Top 0.254: R6.P$8 43.78,57.5 42.22,59.06 IC7.74
C_ARAM_10
  Top 0.254: R6.P$5 46.38,56.96 42.79,60.56 IC7.77
C_ARAM_11
  Top 0.254: IC7.70 38.39,55.27 38.73,54.93 40.48,54.93 40.96,54.45 40.96,52.42 R7.P$6
C_ARAM_12
  Top 0.254: R7.P$7 40.24,54.22 40.01,54.45 38.58,54.45 37.89,55.14 IC7.69
C_BA0
  Top 0.254: IC7.71 38.89,55.73 39.21,55.4 41.12,55.4 41.91,54.61 41.91,52.37 R7.P$5
C_BA1
  Top 0.254: R6.P$7 44.69,57.39 42.7,59.37 42.52,59.56 IC7.75
C_CAS
  Top 0.254: R8.P$6 37.07,53.58 35.39,55.26 IC7.64
C_CLK_RAM
  Top 0.254: R8.P$7 36.27,53.1 33.89,55.49 IC7.61
C_CLKEN
  Top 0.254: IC7.66 36.39,55.05 37.97,53.47 R8.P$5
C_IDE_A0
  Top 0.254: IC2.7 52.41,60.62 43.47,69.56 IC7.95
C_IDE_A1
  Top 0.254: IC2.5 52.7,61.92 44.06,70.56 IC7.97
C_IDE_A2
  Top 0.254: IC7.96 43.76,70.06 52.55,61.27 IC2.6
C_IDE_BUFFER_DIR  (via drill 0.3)
  Top 0.254: IC3.1 66.04,26.67 65.56,27.15 51.44,27.15 | 51.44,27.15 51.44,44.61 56.04,49.21 56.04,61.75 v55.09,62.71 | v52.55,65.72 52.23,65.72 44.89,73.06 IC7.102 | IC3.24 51.44,27.15
  Bottom 0.254: v55.09,62.71 52.55,65.25 v52.55,65.72
C_IDE_CS0
  Top 0.254: IC2.9 52.28,59.32 43.04,68.56 IC7.93
C_IDE_CS1
  Top 0.254: IC2.8 52.27,59.97 43.18,69.06 IC7.94
C_IDE_R
  Top 0.254: IC2.4 53,62.57 44.51,71.06 IC7.98
C_IDE_RESET
  Top 0.254: IC2.2 53.29,63.87 44.6,72.56 IC7.101
C_IDE_W
  Top 0.254: IC2.3 53.14,63.22 44.3,72.06 IC7.100 41.4,72.07
C_LDQ0
  Top 0.254: R9.P$1 33.93,53.86 32.89,54.9 IC7.59
C_LDQ1
  Top 0.254: IC7.58 32.39,54.61 33.03,53.96 R9.P$2
C_RAS
  Top 0.254: R7.P$8 39.34,53.05 37.39,55 IC7.68
C_UDQ0
  Top 0.254: IC7.57 31.89,53.8 32.23,53.45 R9.P$3
C_UDQ1
  Top 0.254: R9.P$4 31.33,52.92 31.39,52.98 IC7.56
C_WE
  Top 0.254: R8.P$8 35.37,53.21 33.39,55.19 IC7.60
CAS
  Top 0.152: IC9.17 40.6,23.4 41,23.8 41,29.16 40.6,29.56 IC8.17 40.6,43.6 41,44 41,47.27 39.37,48.9 37.94,48.9 37.07,49.77 R8.P$3
CBACK
  Top 0.254: X1.A26 5.33,22.61 5.33,8.23 6.1,7.47 11.43,7.47 12.04,8.08 14.63,8.08 17.07,10.52 17.83,10.52 20.57,13.26 20.57,46.93 22.23,48.58 27.94,48.58 28.89,49.53 IC7.51
CBREQ  (via drill 0.3)
  Top 0.254: X1.A25 5.33,28.19 v17.53,28.19 | v19.96,28.19 20.12,28.35 20.12,47.1 22.07,49.05 27.78,49.05 28.39,49.66 IC7.50
  Bottom 0.254: v17.53,28.19 v19.96,28.19
CIIN
  Top 0.254: X1.A27 4.88,20.52 4.88,7.92 5.94,6.86 11.73,6.86 12.34,7.47 14.94,7.47 17.37,9.91 17.98,9.91 21.03,12.95 21.03,46.75 22.38,48.1 28.57,48.1 29.39,48.91 IC7.52
CLK  (via drill 0.3)
  Top 0.254: X1.A19 4.88,42.98 4.88,48.01 5.33,48.46 5.33,49.84 6.1,50.6 19.45,50.6 20.64,51.78 20.64,57.78 21.11,58.26 21.11,60.33 | 21.11,60.33 20.88,60.56 IC7.32 | IC10.4 v46.35,74.3 | v22.54,65.25 22.54,61.75 21.11,60.33
  Bottom 0.254: v46.35,74.3 37.31,65.25 v22.54,65.25
CLK_RAM
  Top 0.152: IC9.38 40.6,29.06 40.2,29.46 40.2,43.7 40.6,44.1 IC8.38 40.6,47.03 39.05,48.58 37.62,48.58 36.27,49.93 R8.P$2
CLKEN
  Top 0.152: IC9.37 41.4,29.26 41,29.66 41,43.5 41.4,43.9 IC8.37 41.4,47.5 39.69,49.21 38.42,49.21 37.97,49.66 R8.P$4
D0
  Top 0.254: X1.B17 7.37,48.01 9.75,48.01 13.63,44.13 IC5.5
D1
  Top 0.254: X1.C17 8.94,46.94 9.75,46.94 13.06,43.63 IC5.6
D2
  Top 0.254: X1.B18 7.32,45.41 9.75,45.41 12.54,42.63 IC5.8
D3
  Top 0.254: X1.C18 8.94,44.5 9.75,44.5 12.12,42.13 IC5.9
D4
  Top 0.254: X1.B19 7.57,43.13 9.75,43.13 11.25,41.63 IC5.10
D5
  Top 0.254: X1.C19 9.75,41.91 11.03,40.63 IC5.12
D6
  Top 0.254: X1.B20 7.67,40.69 9.75,40.69 10.31,40.13 IC5.13
D7
  Top 0.254: X1.C20 8.99,39.47 9.75,39.47 9.91,39.63 IC5.14
D8
  Top 0.254: X1.B21 7.62,38.1 9.75,38.1 10.79,39.13 IC5.15
D9
  Top 0.254: X1.C21 8.94,36.88 9.75,36.88 11.51,38.63 IC5.16
D10
  Top 0.254: X1.B22 7.72,35.66 9.75,35.66 12.22,38.13 IC5.17
D11
  Top 0.254: X1.C22 9.6,34.29 12.44,37.13 IC5.19
D12
  Top 0.254: X1.B23 7.67,33.07 9.75,33.07 13.31,36.63 IC5.20
D13
  Top 0.254: X1.C23 8.99,31.85 9.75,31.85 14.03,36.13 IC5.21
D14
  Top 0.254: X1.B24 7.11,29.21 8.38,30.48 9.75,30.48 14.4,35.13 IC5.23
D15
  Top 0.254: X1.C24 9.7,29.21 15.12,34.63 IC5.24
D16  (via drill 0.3)
  Top 0.254: X1.B25 7.42,27.74 9.91,27.74 13.83,23.81 IC6.5 | IC3.27 v52.7,20.48
  Bottom 0.254: v52.7,20.48 46.51,26.67 10.97,26.67 9.91,27.74 7.42,27.74 X1.B25
D17  (via drill 0.3)
  Top 0.254: X1.C25 9.75,26.67 13.11,23.31 IC6.6 | IC3.30 v54.61,19.84
  Bottom 0.254: v54.61,19.84 52.23,19.84 46.83,25.24 11.18,25.24 9.75,26.67 X1.C25
D18  (via drill 0.3)
  Top 0.254: X1.B26 7.52,25.3 9.75,25.3 12.74,22.31 IC6.8 | IC3.33 v56.52,19.21
  Bottom 0.254: v56.52,19.21 52.07,19.21 46.67,24.61 25.72,24.61 23.02,21.91 13.14,21.91 9.75,25.3 7.52,25.3 X1.B26
D19  (via drill 0.3)
  Top 0.254: X1.C26 8.94,24.08 9.75,24.08 12.02,21.81 IC6.9 | IC3.36 v58.42,18.57
  Bottom 0.254: v58.42,18.57 51.91,18.57 50.64,19.84 13.99,19.84 9.7,24.13 X1.C26
D20  (via drill 0.3)
  Top 0.254: X1.B27 6.4,21.64 7.01,21.64 8.23,22.86 9.3,22.86 10.84,21.31 IC6.10 | IC3.38 v59.69,17.94
  Bottom 0.254: v59.69,17.94 51.75,17.94 50.32,19.37 12.79,19.37 9.3,22.86 7.62,22.86 X1.B27
D21  (via drill 0.3)
  Top 0.254: X1.C27 8.99,21.49 9.6,21.49 10.78,20.31 IC6.12 | IC3.41 v61.59,17.3
  Bottom 0.254: v61.59,17.3 51.59,17.3 50.01,18.89 11.59,18.89 X1.C27
D22  (via drill 0.3)
  Top 0.254: X1.B28 7.16,19.05 8.38,20.27 9.45,20.27 9.91,19.81 IC6.13 | IC3.44 v63.5,16.67
  Bottom 0.254: v63.5,16.67 51.44,16.67 49.69,18.41 11.3,18.41 9.45,20.27 7.57,20.27 X1.B28
D23  (via drill 0.3)
  Top 0.254: X1.C28 9.91,19.05 10.17,19.31 IC6.14 | IC3.47 v65.41,16.03
  Bottom 0.254: v65.41,16.03 51.75,16.03 49.53,13.81 14.92,13.81 9.68,19.05 X1.C28
D24  (via drill 0.3)
  Top 0.254: X1.B29 7.67,17.83 9.91,17.83 10.89,18.81 IC6.15 | IC3.46 v64.77,15.4
  Bottom 0.254: v64.77,15.4 58.42,15.4 58.1,15.08 51.44,15.08 49.69,13.34 14.4,13.34 9.91,17.83 7.67,17.83 X1.B29
D25  (via drill 0.3)
  Top 0.254: X1.C29 8.94,16.46 9.91,16.46 11.76,18.31 IC6.16 | IC3.43 62.87,13.18 v63.18,12.86
  Bottom 0.254: v63.18,12.86 62.71,13.34 59.05,13.34 57.94,14.45 51.44,14.45 49.69,12.7 13.66,12.7 9.86,16.51 X1.C29
D26  (via drill 0.3)
  Top 0.254: X1.B30 7.62,15.24 9.75,15.24 12.32,17.81 IC6.17 | IC3.40 v60.96,11.75
  Bottom 0.254: v60.96,11.75 59.85,11.75 57.63,13.97 51.59,13.97 49.69,12.06 13.02,12.06 9.8,15.28 7.66,15.28 X1.B30
D27  (via drill 0.3)
  Top 0.254: X1.C30 8.94,14.02 9.75,14.02 12.54,16.81 IC6.19 | IC3.37 v59.05,11.27
  Bottom 0.254: v59.05,11.27 56.99,13.34 51.59,13.34 49.69,11.43 12.34,11.43 9.75,14.02 8.94,14.02 X1.C30
D28  (via drill 0.3)
  Top 0.254: X1.B31 7.57,12.65 9.75,12.65 13.42,16.31 IC6.20 | v57.78,10.79 IC3.35 57.78,18.89 56.67,20 56.04,20 53.98,22.07 51.12,22.07 50.64,22.54 50.64,44.45 55.56,49.37 55.56,55.4 42.91,68.06 IC7.92
  Bottom 0.254: v57.78,10.79 11.75,10.79 9.89,12.65 7.57,12.65 X1.B31
D29  (via drill 0.3)
  Top 0.254: X1.C31 9.75,11.43 14.14,15.81 IC6.21 | v55.88,10.16 IC3.32 55.88,19.53 53.82,21.59 50.64,21.59 50.16,22.07 50.16,44.61 55.09,49.53 55.09,55.24 42.77,67.56 IC7.91
  Bottom 0.254: v55.88,10.16 11.11,10.16 9.84,11.43 X1.C31
D30  (via drill 0.3)
  Top 0.254: X1.B32 7.67,10.21 9.75,10.21 14.36,14.81 IC6.23 | v53.98,9.53 IC3.29 53.98,20.16 53.02,21.11 50.16,21.11 49.69,21.59 49.69,44.77 54.61,49.69 54.61,55.09 43.64,66.06 IC7.88
  Bottom 0.254: v53.98,9.53 10.48,9.53 9.79,10.21 7.67,10.21 X1.B32
D31  (via drill 0.3)
  Top 0.254: X1.C32 9.49,8.89 14.91,14.31 IC6.24 | v52.07,8.89 IC3.26 52.07,15.4 49.21,18.26 49.21,44.93 54.13,49.85 54.13,54.93 43.5,65.56 IC7.87
  Bottom 0.254: v52.07,8.89 X1.C32
DRAM_0
  Top 0.254: IC5.43 32.82,39.63 37.4,44.21 IC8.42
DRAM_1
  Top 0.254: IC5.44 31.49,40.13 35.8,44.44 IC8.44
DRAM_2
  Top 0.254: IC5.45 31.08,40.63 35,44.55 IC8.45
DRAM_3
  Top 0.254: IC5.47 30.7,41.63 33.4,44.33 IC8.47
DRAM_4
  Top 0.254: IC5.48 30.44,42.13 32.6,44.29 IC8.48
DRAM_5
  Top 0.254: IC5.49 29.11,42.63 31,44.52 IC8.50
DRAM_6
  Top 0.254: IC5.51 29.2,43.63 30.2,44.63 IC8.51
DRAM_7
  Top 0.254: IC5.52 28.18,44.13 28.6,44.56 IC8.53
DRAM_8
  Top 0.254: IC5.33 25.95,34.63 26.82,35.51 27.93,35.51 28.6,34.84 IC8.2
DRAM_9
  Top 0.254: IC5.34 25.84,35.13 26.67,35.97 29.46,35.97 30.2,35.23 IC8.4
DRAM_10
  Top 0.254: IC5.36 25.62,36.13 25.91,36.42 29.92,36.42 31,35.34 IC8.5
DRAM_11
  Top 0.254: IC5.37 25.51,36.63 25.81,36.94 30.32,36.94 32.6,34.66 IC8.7
DRAM_12
  Top 0.254: IC5.38 25.4,37.13 25.76,37.49 30.68,37.49 33.4,34.77 IC8.8
DRAM_13
  Top 0.254: IC5.40 32.17,38.13 35,35.3 IC8.10
DRAM_14
  Top 0.254: IC5.41 32.59,38.63 35.8,35.42 IC8.11
DRAM_15
  Top 0.254: IC5.42 33.15,39.13 37.4,34.88 IC8.13
DRAM_16
  Top 0.254: IC6.43 33.38,19.31 37.4,23.33 IC9.42
DRAM_17
  Top 0.254: IC6.44 31.9,19.81 35.8,23.71 IC9.44
DRAM_18
  Top 0.254: IC6.45 31.64,20.31 35,23.68 IC9.45
DRAM_19
  Top 0.254: IC6.47 31.11,21.31 33.4,23.6 IC9.47
DRAM_20
  Top 0.254: IC6.48 30.85,21.81 32.6,23.56 IC9.48
DRAM_21
  Top 0.254: IC6.49 29.37,22.31 31,23.94 IC9.50
DRAM_22
  Top 0.254: IC6.51 29.45,23.31 30.2,24.06 IC9.51
DRAM_23
  Top 0.254: IC6.52 28.28,23.81 28.6,24.13 IC9.53
DRAM_24
  Top 0.254: IC6.33 26.05,14.31 26.83,15.09 28.23,15.09 28.6,14.73 IC9.2
DRAM_25
  Top 0.254: IC6.34 25.63,14.81 26.37,15.55 29.3,15.55 30.2,14.65 IC9.4
DRAM_26
  Top 0.254: IC6.36 25.81,15.81 26.04,16.03 29.43,16.03 31,14.46 IC9.5
DRAM_27
  Top 0.254: IC6.37 25.68,16.31 25.88,16.51 30.48,16.51 32.6,14.38 IC9.7
DRAM_28
  Top 0.254: IC6.38 25.54,16.81 25.88,17.14 30.91,17.14 33.4,14.65 IC9.8
DRAM_29
  Top 0.254: IC6.40 31.92,17.81 35,14.73 IC9.10
DRAM_30
  Top 0.254: IC6.41 32.33,18.31 35.8,14.84 IC9.11
DRAM_31
  Top 0.254: IC6.42 33.51,18.81 37.4,14.92 IC9.13
DSACK0  (via drill 0.3)
  Top 0.254: v19.51,30.48 19.66,30.63 19.66,47.28 21.91,49.53 26.99,49.53 27.89,50.43 27.89,55.51 27.89,56.04 IC7.49
  Bottom 0.254: X1.A24 4.37,29.21 5.64,30.48 v19.51,30.48
DSACK1  (via drill 0.3)
  Top 0.254: v24.61,52.39 25.39,53.17 IC7.44
  Bottom 0.254: X1.A18 4.06,44.45 5.33,45.72 9.68,45.72 10.32,46.35 10.32,52.23 10.48,52.39 v24.61,52.39
ECS  (via drill 0.3)
  Top 0.254: X1.B13 7.26,56.24 9.49,56.24 10.79,54.93 v11.75,54.93 | v22.7,54.93 23.02,54.93 23.39,55.3 IC7.40
  Bottom 0.254: v11.75,54.93 v22.7,54.93
GND  (via drill 0.3)  (1 unrouted)
  Top 0.254: IC6.18 17.45,17.31 17.62,17.14 17.63,17.14 v17.68,17.09 | IC6.25 17.44,13.79 17.62,13.97 17.63,13.97 17.68,14.02 v17.68,14.4 | IC3.28 53.34,13.18 v52.86,12.7 | IC6.39 22.98,17.31 v22.97,17.3 | IC8.28 48.62,45.45 v49.53,46.35 | IC2.10 53.92,58.58 v54.77,58.58 | C38.2 13.57,8.89 11.43,8.89 v10.64,8.1
  Top 0.406: C36.2 45.64,75.56 IC10.3
  Bottom 0.254: v17.68,17.09 18.63,17.09 C24.2 | v52.86,12.7 52.86,12.24 C62.2 | C12.2 v38.08,20.68 | v36.51,17.46 38.06,17.46 C14.2 | v22.97,17.3 22.07,17.3 C26.2
  other vias: 14.61,31.59 15.4,31.59 14.61,29.37 15.4,29.37 14.45,44.93 14.45,45.72 38.42,43.5 42.39,30.32 42.23,23.18 42.23,20.8 42.23,14.76 48.42,42.07 31.75,31.91 36.51,31.91 19.84,57.78 19.84,56.99 17.36,77.6 14.61,26.04 13.02,26.04 13.02,27.46 41.12,77.47 41.91,77.47 41.12,78.26 41.91,78.26 49.21,75.56 47.31,73.18 49.21,76.52 21.59,62.87 21.59,63.66 68.74,1.27 67.94,1.27 67.15,1.27 60.33,22.23 65.88,22.07 1.27,1.11 2.06,1.11 1.27,1.91 7.94,99.06 8.89,99.06 7.94,98.27 8.89,98.27 29.05,73.18 32.07,73.18 39.37,72.23 37.94,73.66 21.91,72.71 14.76,74.61 15.4,73.98 24.45,62.55 25.72,61.28 30.96,62.55 32.38,61.28 37.78,60.17 37.78,62.87 26.83,58.1 26.04,44.93 26.83,44.93 26.83,45.72 26.04,45.72 25.88,33.5 26.67,33.5 26.67,32.7 25.88,32.7 25.88,25.88 26.83,25.88
  pour Bottom: 0,100.33 70.01,100.33 70.01,0 0,0
  pour Top (rank 3): 0,100.33 70.01,100.33 70.01,0 0,0
  pour Route2: 0,100.33 70.01,100.33 70.01,0 0,0
IDE_A0
  Top 0.254: IC2.13 61.16,59.97 62.71,58.42 62.71,53.5 SV1.35
IDE_A1
  Top 0.254: IC2.15 62.08,61.27 63.66,59.69 63.66,55.09 SV1.33
IDE_A2
  Top 0.254: IC2.14 61.62,60.62 63.18,59.05 63.18,53.98 64.14,53.02 65.72,53.02 SV1.36
IDE_CS0
  Top 0.254: IC2.11 60.55,58.67 61.75,57.47 61.75,51.91 SV1.37
IDE_CS1
  Top 0.254: IC2.12 60.85,59.32 62.23,57.94 62.23,52.39 64.45,50.16 66.04,50.16 SV1.38
IDE_RST  (via drill 0.3)
  Top 0.254: v55.09,63.82 55.09,63.66 55.52,63.22 IC2.18
  Bottom 0.254: SV1.1 59.21,94.77 55.56,91.12 55.56,64.29 v55.09,63.82
IDE_WAIT  (via drill 0.3)
  Top 0.254: v63.98,29.05 64.97,29.05 R2.2 | IC7.107 42.38,75.56 43.18,76.36 v43.18,76.52 | v54.77,67.47 55.88,67.47 56.04,67.31 63.34,67.31 64.14,68.1 65.41,68.1 65.88,67.63 65.88,63.02 SV1.27
  Bottom 0.254: SV1.27 63.66,60.8 63.66,29.37 v63.98,29.05 | v43.18,76.52 48.1,76.52 48.9,77.31 51.75,77.31 52.7,76.36 52.7,69.53 v54.77,67.47
IDED0  (via drill 0.3)
  Top 0.254: IC3.3 v64.77,25.24
  Bottom 0.254: v64.77,25.24 64.77,25.56 62.71,27.62 62.71,74.14 63.02,74.45 SV1.17
IDED1  (via drill 0.3)
  Top 0.254: IC3.6 v62.87,25.24
  Bottom 0.254: v62.87,25.24 62.87,25.88 61.75,26.99 61.75,76.52 62.23,76.99 SV1.15
IDED2  (via drill 0.3)
  Top 0.254: IC3.9 v60.96,25.24
  Bottom 0.254: SV1.13 61.75,79.53 60.8,78.58 60.8,25.88 60.96,25.72 v60.96,25.24
IDED3  (via drill 0.3)
  Top 0.254: IC3.12 v59.05,25.24
  Bottom 0.254: v59.05,25.24 59.05,26.35 59.85,27.15 59.85,81.44 60.48,82.07 SV1.11
IDED4  (via drill 0.3)
  Top 0.254: IC3.14 v57.78,25.24
  Bottom 0.254: v57.78,25.24 57.78,26.35 58.9,27.46 58.9,83.82 59.69,84.61 SV1.9
IDED5  (via drill 0.3)
  Top 0.254: IC3.17 v55.88,25.24
  Bottom 0.254: v55.88,25.24 55.88,26.19 57.94,28.26 57.94,86.36 58.74,87.15 SV1.7
IDED6  (via drill 0.3)
  Top 0.254: IC3.20 v53.98,25.24
  Bottom 0.254: v53.98,25.24 53.98,26.19 56.99,29.21 56.99,88.74 57.94,89.69 SV1.5
IDED7  (via drill 0.3)
  Top 0.254: IC3.23 v52.07,25.24
  Bottom 0.254: v52.07,25.24 52.07,26.19 56.04,30.16 56.04,90.65 57.63,92.23 SV1.3
IDED8  (via drill 0.3)
  Top 0.254: IC3.22 v52.7,25.88 | v38.73,87 52.55,87 56.67,91.12 66.04,91.12 SV1.4
  Bottom 0.254: v52.7,25.88 56.52,29.69 56.52,89.53 58.1,91.12 66.04,91.12 SV1.4 | IC4.13 36.67,83.82 38.73,85.88 v38.73,87
IDED9  (via drill 0.3)
  Top 0.254: IC3.19 v54.61,25.88 | v38.1,86.36 53.18,86.36 55.24,88.42 65.88,88.42 SV1.6
  Bottom 0.254: v54.61,25.88 57.47,28.73 57.47,87.15 58.74,88.42 65.88,88.42 SV1.6 | IC4.14 v38.1,86.36
IDED10  (via drill 0.3)
  Top 0.254: IC3.16 v56.52,25.88 | v37.47,87.63 37.47,84.77 37.78,84.45 52.23,84.45 53.66,85.88 65.88,85.88 SV1.8
  Bottom 0.254: v56.52,25.88 58.42,27.78 58.42,85.09 59.21,85.88 65.88,85.88 SV1.8 | IC4.15 33.66,87.63 v37.47,87.63
IDED11  (via drill 0.3)
  Top 0.254: IC3.13 v58.42,25.88 | v36.83,89.06 36.83,84.3 37.15,83.98 52.55,83.98 53.18,84.61 61.12,84.61 62.39,83.34 65.88,83.34 SV1.10
  Bottom 0.254: v58.42,25.88 58.42,26.35 59.37,27.3 59.37,82.55 60.17,83.34 65.88,83.34 SV1.10 | IC4.17 33.66,90.17 35.72,90.17 v36.83,89.06
IDED12  (via drill 0.3)
  Top 0.254: IC3.11 v59.69,25.88 | IC4.18 36.2,90.17 36.2,83.82 36.51,83.5 52.86,83.5 53.34,83.98 60.17,83.98 63.34,80.8 65.88,80.8 SV1.12
  Bottom 0.254: SV1.12 65.88,80.8 60.8,80.8 60.33,80.33 60.33,26.51 v59.69,25.88
IDED13  (via drill 0.3)
  Top 0.254: IC3.8 v61.59,25.88 | IC4.19 33.66,90.17 33.66,85.09 35.88,82.87 53.18,82.87 53.66,83.34 59.85,83.34 61.91,81.28 61.91,78.9 62.55,78.26 65.88,78.26 SV1.14
  Bottom 0.254: SV1.14 65.88,78.26 62.55,78.26 61.28,76.99 61.28,26.19 v61.59,25.88
IDED14  (via drill 0.3)
  Top 0.152: 31.27,92.23 31.27,85.57 31.75,85.09
  Top 0.254: IC3.5 v63.5,25.72 | IC4.20 33.66,92.71 31.75,92.71 31.27,92.23 | 31.75,85.09 32.86,85.09 35.88,82.07 53.34,82.07 53.98,82.71 59.53,82.71 61.28,80.96 61.28,77.15 62.55,75.88 66.04,75.88 SV1.16
  Bottom 0.254: v63.5,25.72 63.5,26.04 62.23,27.3 62.23,74.61 63.18,75.56 65.72,75.56 SV1.16
IDED15  (via drill 0.3)
  Top 0.254: IC3.2 v65.41,25.72 | SV1.18 66.04,73.34 63.34,73.34 60.64,76.04 60.64,80.49 59.05,82.07 54.29,82.07 53.66,81.44 37.31,81.44 v35.72,81.44
  Bottom 0.254: v65.41,25.72 63.18,27.94 63.18,72.39 63.98,73.18 65.88,73.18 SV1.18 | IC4.21 31.11,95.25 31.11,82.55 32.23,81.44 v35.72,81.44
IO_EXP
  Top 0.254: X1.A20 3.81,39.47 5.33,41 5.33,47.4 6.4,48.46 18.48,48.46 21.11,51.09 21.11,54.45 22.07,55.4 22.23,55.4 22.38,55.56 IC7.38
KEY_PIN_POWER
  Top 0.813: SV1.20 65.83,70.59 59.75,70.59 C17.1
  Top 1.27: R3.1 58.26,71.64 C17.1
LDQ0
  Top 0.152: IC8.39 39.8,46.72 38.58,47.94 35.4,47.94 33.93,49.41 R9.P$8
LDQ1
  Top 0.152: IC9.39 39.8,28.86 39.4,29.26 39.4,46.4 38.17,47.62 34.77,47.62 33.03,49.36 R9.P$7
LE_30_RAM
  Top 0.254: 18.29,25.3 18.29,13.26 17.82,12.79 IC6.27 14.85,12.79 14.45,12.38 C38.1 | 18.29,25.3 18.29,33.05 | 18.29,33.05 18.29,45.64 | IC6.2 18.27,25.31 18.29,25.3 | IC5.27 18.23,33.11 18.29,33.05 | IC5.2 18.28,45.63 18.29,45.64 | 18.29,45.64 18.29,47.5 21.43,50.64 25.88,50.64 26.39,51.15 IC7.46
LE_RAM_30
  Top 0.254: 22.25,25.3 22.25,13.11 22.55,12.81 IC6.30 25.92,12.81 26.43,12.3 C37.1 | 22.25,25.3 22.25,33.07 | 22.25,33.07 22.25,45.57 | 22.25,45.57 22.25,46.63 22.77,47.15 29.53,47.15 30.39,48.01 IC7.54 | IC5.55 22.32,45.63 22.25,45.57 | IC6.55 22.26,25.31 22.25,25.3 | IC5.30 22.31,33.13 22.25,33.07
N$1
  Top 0.406: SJ1.2 45.24,79.53 C36.1 45.33,76.83 IC10.2
N$4
  Top 0.254: IC10.7 54.61,76.83 54.87,76.57 R10.1
N$5
  Top 0.254: R11.1 53.23,79.39 IC10.8
N$8
  Top 0.254: SJ2.2 51.44,73.82 51.91,74.3 IC10.5
N$25
  Top 0.254: J1.2 65.41,34.82 R1.1
N$26
  pour Route15: 18.59,92.51 20.73,92.51 20.73,90.22 18.59,90.22
OE_30_RAM  (via drill 0.3)
  Top 0.254: IC6.28 17.93,12.29 18.9,13.26 v18.9,25.93 v18.9,32.33 v18.9,46.28 18.9,47.31 21.59,50.01 26.51,50.01 27.39,50.88 27.39,55.8 27.39,56.04 IC7.48 | IC6.1 17.56,25.81 v17.68,25.93 | IC5.1 17.51,46.13 v17.65,46.28 | IC5.28 17.38,32.61 v17.65,32.33
  Bottom 0.254: v17.68,25.93 v18.9,25.93 | v17.65,46.28 v18.9,46.28 | v17.65,32.33 v18.9,32.33
OE_RAM_30  (via drill 0.3)
  Top 0.254: IC6.29 22.28,12.31 21.64,12.95 v21.64,25.91 v21.64,32.46 v21.64,46.33 21.64,46.72 22.54,47.62 29.05,47.62 29.89,48.46 IC7.53 | IC5.56 23.06,46.13 v22.86,46.33 | IC6.56 22.96,25.81 v22.86,25.91 | IC5.29 23.03,32.63 v22.86,32.46
  Bottom 0.254: v22.86,46.33 v21.64,46.33 | v22.86,25.91 v21.64,25.91 | v22.86,32.46 v21.64,32.46
PLL_CLK_FULL
  Top 0.254: R10.2 55.09,72.23 54.13,71.28 SJ2.3 52.96,70.1 52.39,69.53 49.05,69.53 45.03,73.56 IC7.103
PLL_CLK_HALF
  Top 0.254: R11.2 51.38,79 50.01,77.63 50.01,71.37 SJ2.1 49.75,71.44 49.59,71.28 47.94,71.28 45.16,74.06 IC7.104
R/W  (via drill 0.3)
  Top 0.254: X1.B15 7.32,53.03 11.09,53.03 v11.11,53.02 | v24.13,53.02 24.89,53.78 IC7.43
  Bottom 0.254: v11.11,53.02 v24.13,53.02
RAM_SEL  (via drill 0.3)
  Top 0.254: X1.A17 3.81,47.85 4.72,48.77 4.72,49.99 5.79,51.05 9.31,51.05 10,51.75 v11.11,51.75 | IC7.45 25.88,56.55 25.88,52.7 24.92,51.75 v24.13,51.75
  Bottom 0.254: v11.11,51.75 v24.13,51.75
RAS
  Top 0.152: IC9.18 41.4,23.4 41.8,23.8 41.8,29.36 41.4,29.76 IC8.18 41.4,43.4 41.8,43.8 41.8,47.73 39.34,50.2 R7.P$1
ROM_B0  (via drill 0.3)
  Top 0.152: v29.21,89.53 28.73,89.06 28.73,80.33
  Top 0.254: 28.73,80.33 27.89,79.48 IC7.132
  Bottom 0.254: IC4.1 24.13,89.53 v29.21,89.53
ROM_B1  (via drill 0.3)
  Top 0.152: v30,90.33 30.96,89.38 30.96,81.76
  Top 0.254: IC7.131 28.39,79.19 30.96,81.76
  Bottom 0.254: IC4.30 20.95,92.71 24.61,92.71 26.99,90.33 v30,90.33
ROM_EN
  Top 0.152: 28.42,90.33 28.42,80.64 27.39,79.62
  Top 0.254: IC4.22 32.07,93.98 28.42,90.33 | 27.39,79.62 IC7.133
ROM_OE
  Top 0.254: IC4.24 26.04,90.17 26.04,82.87 26.89,82.01 IC7.134
ROM_WE
  Top 0.254: IC4.31 23.5,92.71 23.5,82.87 26.39,79.97 IC7.135
S0  (via drill 0.3)
  Top 0.254: R12.1 54.67,77.47 52.23,77.47 51.91,77.15 51.91,76.04 v51.99,75.96 52.39,75.56 IC10.6 | v43.97,74.93 43.6,74.56 IC7.105
  Bottom 0.254: v51.99,75.96 50.96,74.93 v43.97,74.93
S1  (via drill 0.3)
  Top 0.254: R13.1 47.74,78.91 IC10.1 v46.35,78.11 | v44.29,78.11 44.29,76.2 43.81,75.72 43.5,75.72 42.83,75.06 IC7.106
  Bottom 0.254: v46.35,78.11 v44.29,78.11
SIZ0
  Top 0.254: X1.A12 5.28,58.22 9.48,58.22 10.32,59.06 IC7.35
SIZ1
  Top 0.254: X1.B12 7.37,58.67 9.3,58.67 10.19,59.56 IC7.34
STERM
  Top 0.254: X1.A11 5.38,60.66 12.65,60.66 13.05,61.06 IC7.31
TCK  (via drill 0.3)
  Top 0.254: IC7.67 36.89,73.6 35.56,74.93 v33.34,74.93
  Bottom 0.254: v33.34,74.93 33.34,77.31 44.61,88.58 SV2.1
TDI  (via drill 0.3)
  Top 0.254: IC7.63 34.89,72.99 v34.92,73.03
  Bottom 0.254: v34.92,73.03 34.92,73.98 SV2.9
TDO  (via drill 0.3)
  Top 0.254: IC7.122 32.89,76.49 33.02,76.36 34.13,76.36 v34.29,76.52
  Bottom 0.254: v34.29,76.52 47.15,89.38 SV2.3
TMS  (via drill 0.3)
  Top 0.254: IC7.65 35.89,73.17 34.77,74.3 v33.97,74.3
  Bottom 0.254: v33.97,74.3 33.97,74.93 49.69,90.65 SV2.5
UDQ0
  Top 0.152: IC8.15 39,43.8 38.6,44.2 38.6,46.4 37.69,47.31 34.45,47.31 32.23,49.52 R9.P$6
UDQ1
  Top 0.152: IC9.15 39,23.4 39.4,23.8 39.4,28.76 38.6,29.56 38.6,42.45 37.8,43.25 37.8,46.66 37.47,46.99 33.18,46.99 31.33,48.84 R9.P$5
VCC  (via drill 0.3, 0.5, 0.6)
  Top 0.254: R1.2 65.25,31.93 v65.3,31.88 65.25,31.83 R2.1 | IC3.31 v55.24,12.65 | IC3.42 62.23,12.62 v62.2,12.65 | IC3.7 62.23,22.28 v62.2,22.25 | IC3.18 55.24,22.36 v55.35,22.25 | IC2.1 54.9,65.58 v54.9,66.58
  Top 0.305: IC2.20 58.99,64.52 58.42,65.09 58.42,66.12 C59.1
  Top 0.406: C59.1 55.28,66.2 v54.9,66.58 | R12.2 54.77,79.59 v54.77,81.29 54.46,81.29 53.98,80.8 50.16,80.8 | SJ1.3 47.4,80.8 50.16,80.8 | R13.2 50.16,79.64 50.16,80.8
  Top 0.813: v15.54,92.81 15.48,92.75 C58.1 IC4.32 | v54.77,81.29 57.78,81.29 58.26,80.8 R3.2
  Top 1.422: 15.24,4.05 C1.1 | C1.1 12.7,3.54 v12.7,5.08 v12.7,6.35 | IC1.3 15.24,4.04 C1.1
  Bottom 0.254: v62.2,12.65 62.2,11.64 C63.1 | v62.2,22.25 62.2,21.25 C61.1 | C62.1 55.22,12.62 v55.24,12.65 | C60.1 55.32,22.28 v55.35,22.25
  other vias: 12.7,3.81
  pour Route15 (rank 3): 0,100.33 70.01,100.33 70.01,0 0,0
WE
  Top 0.152: IC9.16 39.8,23.4 40.2,23.8 40.2,28.96 39.8,29.36 IC8.16 39.8,43.8 40.2,44.2 40.2,46.8 38.73,48.26 36.67,48.26 35.37,49.56 R8.P$1

## Text on the board
Top: TOP | (C)2016 Matthias Heinrichs / 68030-SDRAM-IDE V0.9
Bottom: BOT
tNames: TOP | (C)2016 Matthias Heinrichs / 68030-SDRAM-IDE V0.9
bNames: BOT